# Altium schematic sheet ldr.SchDoc
size A4; DocumentNumber: 5; SheetNumber: 5; SheetTotal: 5
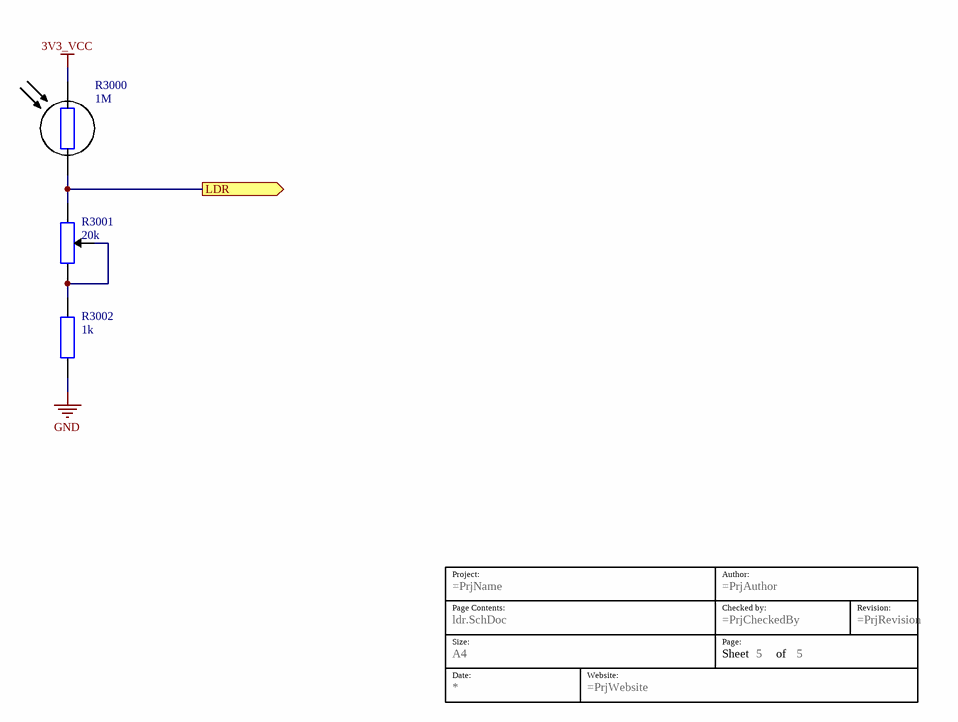
[diagram p0: ldr.SchDoc]

## Parts
*?  Size: A4  (hidden comment: TITLE BLOCK)  (graphical)
R3000  1M  [TH-LDR]
R3001  20k  [POTENTIOMETER]
R3002  1k  [AXIAL RESISTOR]

## Ports
LDR (out)

## Nets
3V3_VCC: R3000.1
GND: R3002.2
LDR: R3000.2 R3001.1 ; port LDR
NetR3001_2: R3001.2 R3001.3 R3002.1

## Notes on the sheet
- (in symbol TITLE BLOCK) Project:; Author:; Page Contents:; Checked by:; Revision:; Size:; Page:; Sheet; of; Date:; Website:

## Library data of the parts
R3000 = LDR: LIGHT DEPENDENT RESISTOR
R3001 = POTMETER
R3002 = RESISTOR: GENERIC RESISTOR